# Altium schematic sheet rev02_13.SchDoc
size 282 x 200 mm
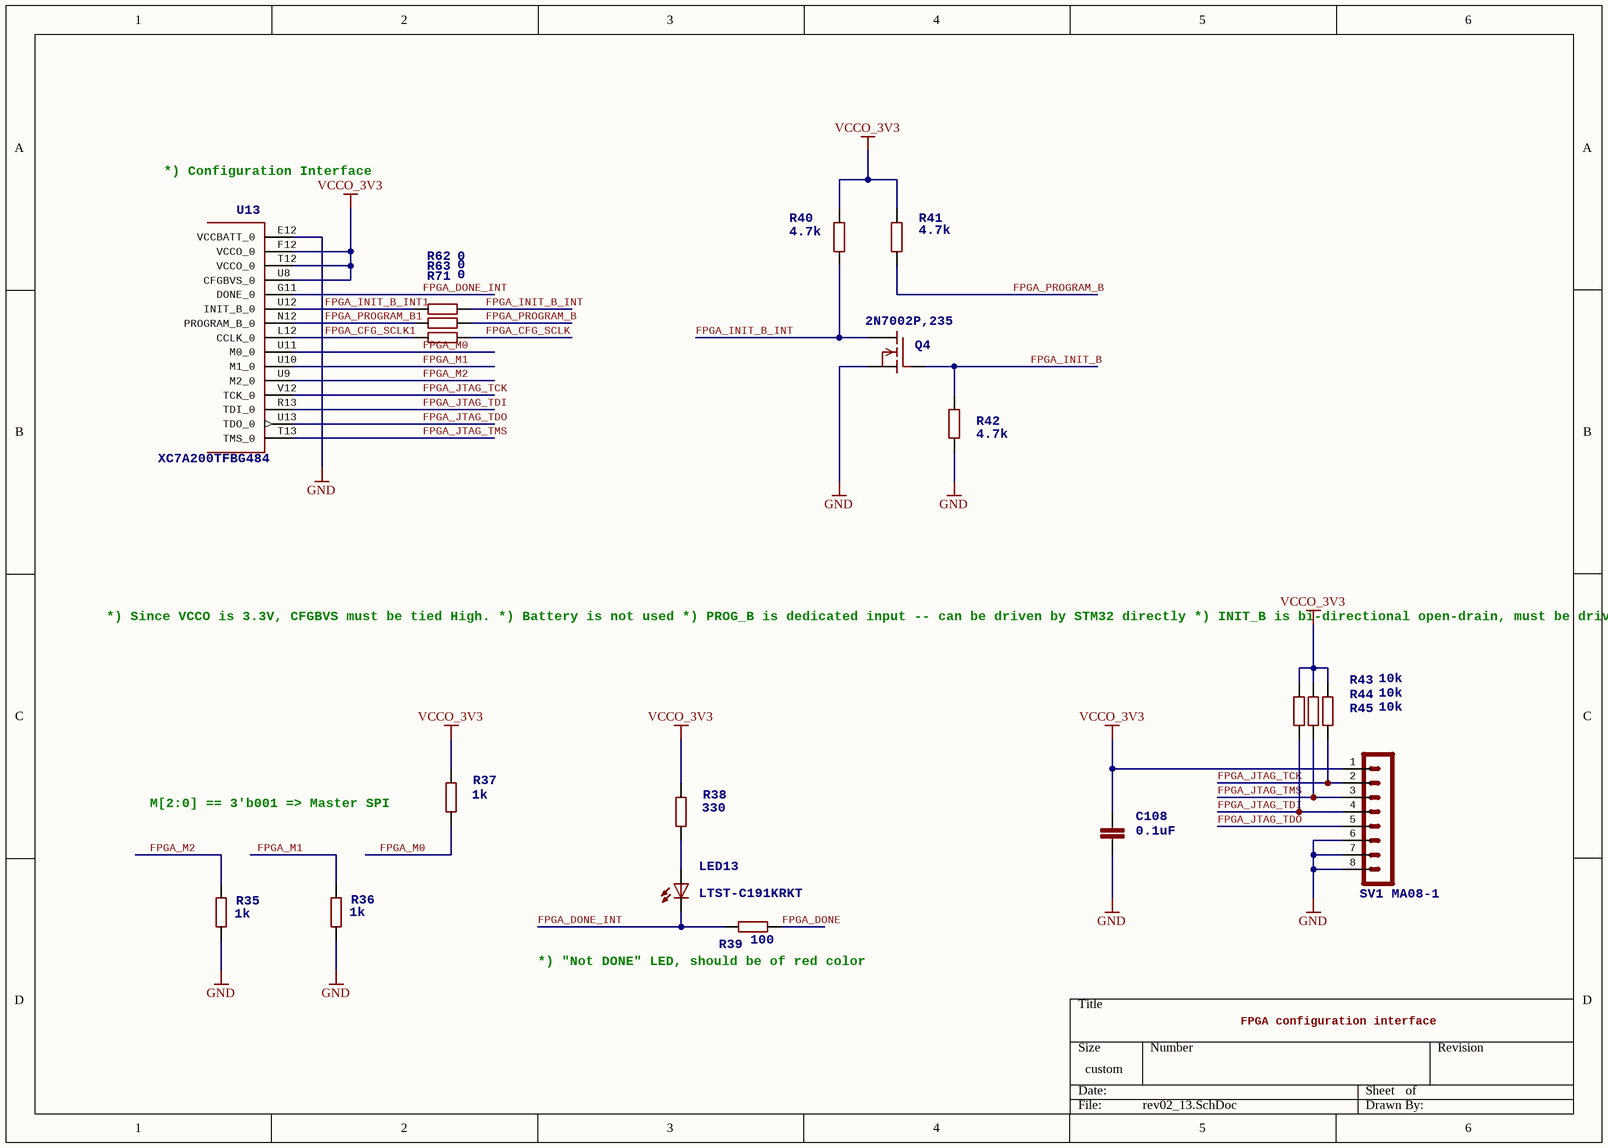
[diagram p0: rev02_13.SchDoc]

## Parts
C108  value 0.1uF  >NAME: C108  [C_0402]
LED13  LTST-C191KRKT  [VD_0603]
Q4  2N7002P,235  >NAME: Q4  [SOT-23]
R35  value 1k  >NAME: R35  [R_0402]
R36  value 1k  >NAME: R36  [R_0402]
R37  value 1k  [R_0402]
R38  value 330  [R_0402]
R39  value 100  >NAME: R39  [R_0402]
R40  value 4.7k  [R_0402]
R41  value 4.7k  [R_0402]
R42  value 4.7k  [R_0402]
R43  value 10k  [R_0402]
R44  value 10k  [R_0402]
R45  value 10k  [R_0402]
R62  value 0  [R_0402]
R63  value 0  [R_0402]
R71  value 0  [R_0402]
SV1  MA08-1  [PLS-8]
U13  >NAME: U13  [BGA484C100P22X22_2300X2300X254]  (hidden comment: XC7A200TFBG484)  (part A of 17)

## Nets
GND: C108.2 Q4.2(S) R35.1 R36.1 R42.1 SV1.6 SV1.7 SV1.8 U13.E12(VCCBATT_0)
VCCO_3V3: C108.1 R37.2 R38.2 R40.2 R41.2 R43.2 R44.2 R45.2 SV1.1 U13.F12(VCCO_0) U13.T12(VCCO_0) U13.U8(CFGBVS_0)
FPGA_CFG_SCLK: R71.1
FPGA_CFG_SCLK1: R71.2 U13.L12(CCLK_0)
FPGA_DONE: R39.1
FPGA_DONE_INT: LED13.2(C) R39.2 U13.G11(DONE_0)
FPGA_INIT_B: Q4.1(G) R42.2
FPGA_INIT_B_INT: Q4.3(D) R40.1 R62.1
FPGA_INIT_B_INT1: R62.2 U13.U12(INIT_B_0)
FPGA_JTAG_TCK: R45.1 SV1.2 U13.V12(TCK_0)
FPGA_JTAG_TDI: R43.1 SV1.4 U13.R13(TDI_0)
FPGA_JTAG_TDO: SV1.5 U13.U13(TDO_0)
FPGA_JTAG_TMS: R44.1 SV1.3 U13.T13(TMS_0)
FPGA_M0: R37.1 U13.U11(M0_0)
FPGA_M1: R36.2 U13.U10(M1_0)
FPGA_M2: R35.2 U13.U9(M2_0)
FPGA_PROGRAM_B: R41.1 R63.1
FPGA_PROGRAM_B1: R63.2 U13.N12(PROGRAM_B_0)
NetLED13_1: LED13.1(A) R38.1

## Notes on the sheet
- *) Configuration Interface
- *) Since VCCO is 3.3V, CFGBVS must be tied High.
  *) Battery is not used
  *) PROG_B is dedicated input -- can be driven by STM32 directly
  *) INIT_B is bi-directional open-drain, must be driven with MOSFET to ground
- M[2:0] == 3'b001 => Master SPI
- (near R39) *) "Not DONE" LED, should be of red color
- FPGA configuration interface

## Library data of the parts
C108 = C-EUC0402: 0402 CAPACITOR; DIELECTRIC: X7R; RATED_VOLTAGE: 50V; TOLERANCE: 10%; >VALUE: 0.1 uF
LED13 = LEDCHIP-LED0603: RED LED
Q4 = 2N7002: OnSemi FET; >VALUE: 2N7002
R35-R45 = R-EU_R0402: 0402 Resistor 5%
  R35 R36 R39: TOLERANCE: 5%
R62 R63 R71 = R-EU_R0603: 0402 Resistor 5%
SV1 = MA08-1: PIN HEADER 0.1"; OC_FARNELL: unknown; OC_NEWARK: unknown
U13 = XC7A200TFBG484: Xilinx FPGA: XC7A200TFBG484; MPN: XC7A200T-1FBG484C; MFR: Xilinx; OC_DIGIKEY: 122-1871-ND; >VALUE: XC7A200TFBG484